# Altium schematic sheet Power_MUX.SchDoc
size A4; SheetNumber: 12; SheetTotal: 13
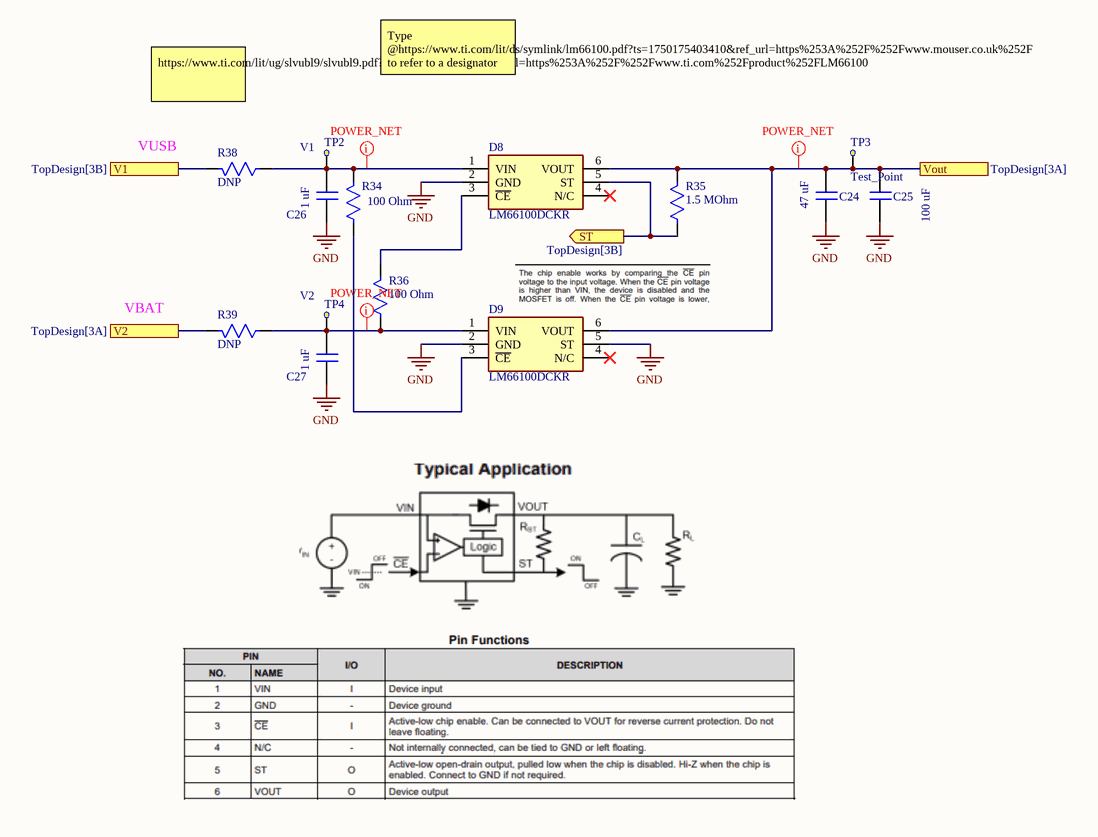
[diagram p0: Power_MUX.SchDoc]

## Parts
C24  47 uF  [CAP SMD 1206]
C25  100 uF  [CAP SMD 1206]
C26  1 uF  [CAP_0603]
C27  1 uF  [CAP_0603]
D8  LM66100DCKR  [LM66100DCKR]
D9  LM66100DCKR  [LM66100DCKR]
R34  100 Ohm  [Res_0603]
R35  1.5 MOhm  [Res_0603]
R36  100 Ohm  [Res_0603]
R38  DNP  [RES_0402]
R39  DNP  [RES_0402]
TP2  V1  [Test_Point]
TP3  Test_Point  [Test_Point]
TP4  V2  [Test_Point]

## Ports
ST (out, see TopDesign[3B]), V1 (see TopDesign[3B]), V2 (see TopDesign[3A]), Vout (see TopDesign[3A])

## Nets
GND: C24.1 C25.1 C26.1 C27.1 D8.2(GND) D9.2(GND) D9.5(ST)
ST: D8.5(ST) R35.2 ; port ST
V1: R38.1 ; port V1
V2: R39.1 ; port V2
Vout: C24.2 C25.2 D8.6(VOUT) D9.6(VOUT) R35.1 TP3.TP?(Ref_Point) ; port Vout
NetC26_2: C26.2 D8.1(VIN) R34.1 R38.2 TP2.TP?(Ref_Point)
NetC27_2: C27.2 D9.1(VIN) R36.2 R39.2 TP4.TP?(Ref_Point)
NetD8_3: D8.3(~{CE}) R36.1
NetD9_3: D9.3(~{CE}) R34.2

Not connected (* = marked no-connect by the designer): D8 4(N/C)*; D9 4(N/C)*

## Layout directives
mark named POWER_NET: NetC26_2, NetC27_2, Vout

## Notes on the sheet
- https://www.ti.com/lit/ug/slvubl9/slvubl9.pdf?ts=1750260250038&ref_url=https%253A%252F%252Fwww.ti.com%252Fproduct%252FLM66100
- Type @https://www.ti.com/lit/ds/symlink/lm66100.pdf?ts=1750175403410&ref_url=https%253A%252F%252Fwww.mouser.co.uk%252F to refer to a designator or a net
- (near R38) VUSB
- VBAT

## Library data of the parts
C24-C27 = Cap SMD: Cap SMD.
D8 D9 = LM66100DCKR: +/-6-V, Low IQ ideal diode with input polarity protection; Manufacturer_Name: Texas Instruments; Geometry.Height: 1.1mm; Manufacturer_Part_Number: LM66100DCKR; Datasheet Link: http://www.ti.com/lit/gpn/LM66100; LCSC: C2869734; FootPrint: SC-70-6
R34-R36 R38 R39 = Res smd: SMD Resistor; MP: RC0805FR-07330RL; MF: Yageo; Package: 2012 Rohm Semiconductor; Value: *; SnapEDA_Link: https://www.snapeda.com/parts/RC0805FR-07330RL/Yageo/view-part/106115/?ref=snap; Price: None; Availability: Unavailable
TP2 TP4 = Test_Point